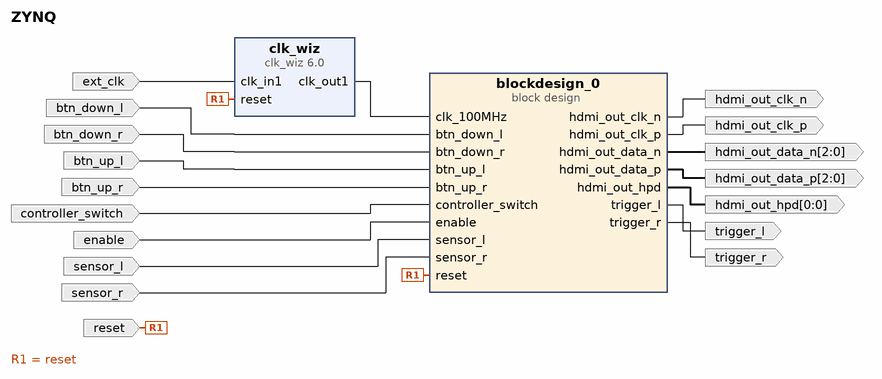
[diagram p0: block diagram of the top level]
# Vivado block design ZYNQ, xc7z020clg400-1, Vivado 2023.1
create_bd_design ZYNQ

create_bd_port -dir I -type clk ext_clk
set_property -dict {CONFIG.CLK_DOMAIN blockdesign_ext_clk CONFIG.FREQ_HZ 12000000} [get_bd_ports ext_clk]
create_bd_port -dir I enable
create_bd_port -dir I btn_down_r
create_bd_port -dir I btn_up_r
create_bd_port -dir I btn_down_l
create_bd_port -dir I btn_up_l
create_bd_port -dir I controller_switch
create_bd_port -dir I sensor_r
create_bd_port -dir I -type rst reset
set_property -dict {CONFIG.POLARITY ACTIVE_HIGH} [get_bd_ports reset]
create_bd_port -dir I sensor_l
create_bd_port -dir O trigger_l
create_bd_port -dir O trigger_r
create_bd_port -dir O -from 0 -to 0 hdmi_out_hpd
create_bd_port -dir O -type clk hdmi_out_clk_p
create_bd_port -dir O -type clk hdmi_out_clk_n
create_bd_port -dir O -from 2 -to 0 hdmi_out_data_p
create_bd_port -dir O -from 2 -to 0 hdmi_out_data_n

create_bd_cell -type ip -vlnv xilinx.com:ip:clk_wiz:6.0 clk_wiz
set_property -dict [list \
  CONFIG.CLKIN1_JITTER_PS 833.33 \
  CONFIG.CLKOUT1_JITTER 479.872 \
  CONFIG.CLKOUT1_PHASE_ERROR 668.310 \
  CONFIG.CLKOUT2_JITTER 124.615 \
  CONFIG.CLKOUT2_PHASE_ERROR 96.948 \
  CONFIG.CLKOUT2_REQUESTED_OUT_FREQ 100.000 \
  CONFIG.CLKOUT2_USED false \
  CONFIG.CLK_IN1_BOARD_INTERFACE Custom \
  CONFIG.MMCM_CLKFBOUT_MULT_F 62.500 \
  CONFIG.MMCM_CLKIN1_PERIOD 83.333 \
  CONFIG.MMCM_CLKIN2_PERIOD 10.0 \
  CONFIG.MMCM_CLKOUT0_DIVIDE_F 7.500 \
  CONFIG.MMCM_CLKOUT1_DIVIDE 1 \
  CONFIG.NUM_OUT_CLKS 1 \
  CONFIG.PRIM_IN_FREQ 12 \
  CONFIG.USE_BOARD_FLOW true \
  CONFIG.USE_LOCKED false \
] [get_bd_cells clk_wiz]
create_bd_cell -type container -reference PONG blockdesign_0
set_property -dict [list \
  CONFIG.ACTIVE_SIM_BD PONG.bd \
  CONFIG.ACTIVE_SYNTH_BD PONG.bd \
  CONFIG.ENABLE_DFX 0 \
  CONFIG.LIST_SIM_BD PONG.bd \
  CONFIG.LIST_SYNTH_BD PONG.bd \
  CONFIG.LOCK_PROPAGATE 0 \
] [get_bd_cells blockdesign_0]

# ---- connections ----

connect_bd_net [get_bd_pins blockdesign_0/hdmi_out_clk_n] [get_bd_ports hdmi_out_clk_n]
connect_bd_net [get_bd_pins blockdesign_0/hdmi_out_clk_p] [get_bd_ports hdmi_out_clk_p]
connect_bd_net [get_bd_pins blockdesign_0/hdmi_out_data_n] [get_bd_ports hdmi_out_data_n]
connect_bd_net [get_bd_pins blockdesign_0/hdmi_out_data_p] [get_bd_ports hdmi_out_data_p]
connect_bd_net [get_bd_pins blockdesign_0/hdmi_out_hpd] [get_bd_ports hdmi_out_hpd]
connect_bd_net [get_bd_pins blockdesign_0/trigger_l] [get_bd_ports trigger_l]
connect_bd_net [get_bd_pins blockdesign_0/trigger_r] [get_bd_ports trigger_r]
connect_bd_net [get_bd_ports btn_down_l] [get_bd_pins blockdesign_0/btn_down_l]
connect_bd_net [get_bd_ports btn_down_r] [get_bd_pins blockdesign_0/btn_down_r]
connect_bd_net [get_bd_ports btn_up_l] [get_bd_pins blockdesign_0/btn_up_l]
connect_bd_net [get_bd_ports btn_up_r] [get_bd_pins blockdesign_0/btn_up_r]
connect_bd_net -net clk_100MHz_1 [get_bd_pins clk_wiz/clk_out1] [get_bd_pins blockdesign_0/clk_100MHz]
connect_bd_net -net clk_in_1 [get_bd_ports ext_clk] [get_bd_pins clk_wiz/clk_in1]
connect_bd_net [get_bd_ports controller_switch] [get_bd_pins blockdesign_0/controller_switch]
connect_bd_net [get_bd_ports enable] [get_bd_pins blockdesign_0/enable]
connect_bd_net [get_bd_ports reset] [get_bd_pins clk_wiz/reset] [get_bd_pins blockdesign_0/reset]
connect_bd_net [get_bd_ports sensor_l] [get_bd_pins blockdesign_0/sensor_l]
connect_bd_net [get_bd_ports sensor_r] [get_bd_pins blockdesign_0/sensor_r]

validate_bd_design
save_bd_design
